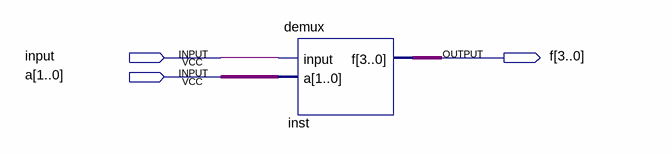
[diagram p0: schematic sheet]
// Quartus schematic Block1.bdf as structural Verilog: 1 symbols, 3 pins
module Block1 (
  input  \input ,
  input  [1:0] a,
  output [3:0] f
);

  demux inst (.\input (\input ), .a(a), .f(f));
endmodule
